# Altium schematic sheet [7] LCD.SchDoc
size A4
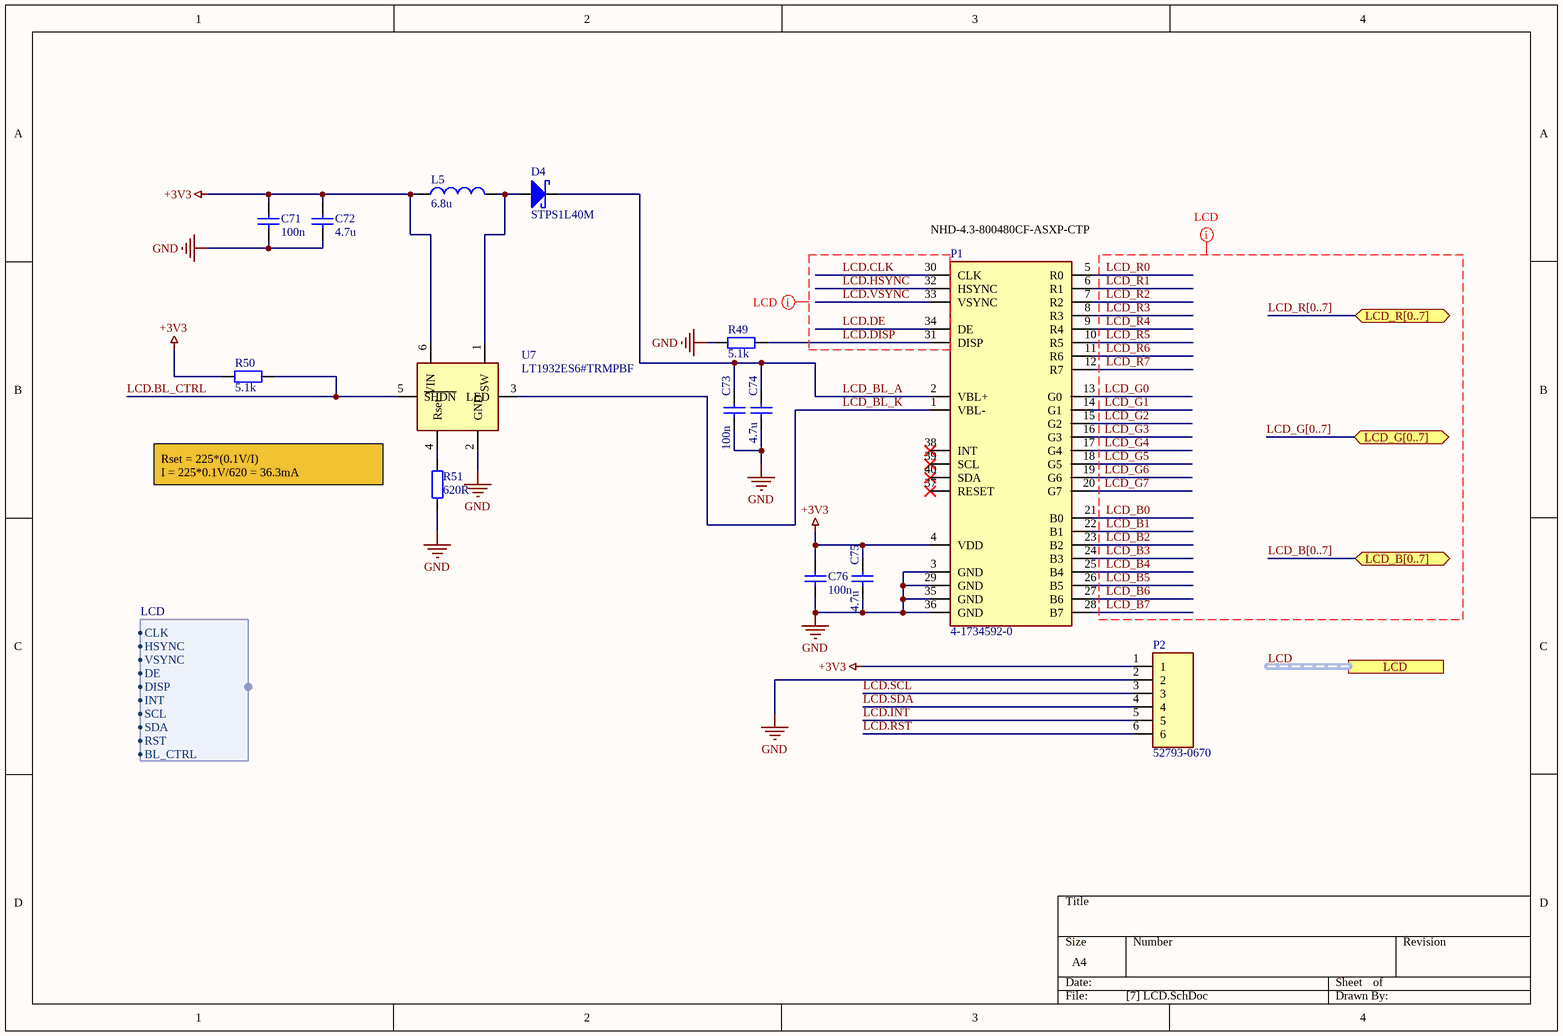
[diagram p0: [7] LCD.SchDoc]

## Parts
C71  100n  [Capacitor 0603]
C72  4.7u  [Capacitor 0603]
C73  100n  [Capacitor 0603]
C74  4.7u  [Capacitor 0603]
C75  4.7u  [Capacitor 0603]
C76  100n  [Capacitor 0603]
D4  STPS1L40M  [DO216-AA]
L5  6.8u  [Inductor ASPI]
P1  4-1734592-0  [Mechanical FFC 0.5mm 40pin]
P2  52793-0670  [Mechanical FFC 1mm 6 pin]
R49  5.1k  [Resistor 0603]
R50  5.1k  [Resistor 0603]
R51  620R  [Resistor 0603]
U7  LT1932ES6#TRMPBF  [SOT23-6]

## Ports
LCD (harness LCD), LCD_B[0..7] (bidir), LCD_G[0..7] (bidir), LCD_R[0..7] (bidir)

## Harnesses
LCD: HSYNC, CLK, VSYNC, DISP, INT, SCL, DE, SDA, RST, BL_CTRL

## Nets
+3V3: C71.2 C72.2 C75.2 C76.2 L5.1 P1.4(VDD) P2.1 R50.1 U7.6(VIN)
GND: C71.1 C72.1 C73.1 C74.1 C75.1 C76.1 P1.3(GND) P1.29(GND) P1.35(GND) P1.36(GND) P2.2 R49.1 R51.1 U7.2(GND)
LCD.BL_CTRL: R50.2 U7.5(~{SHDN})
LCD.CLK: P1.30(CLK)
LCD.DE: P1.34(DE)
LCD.DISP: P1.31(DISP) R49.2
LCD.HSYNC: P1.32(HSYNC)
LCD.INT: P2.5
LCD.RST: P2.6
LCD.SCL: P2.3
LCD.SDA: P2.4
LCD.VSYNC: P1.33(VSYNC)
LCD_B0: P1.21(B0)
LCD_B1: P1.22(B1)
LCD_B2: P1.23(B2)
LCD_B3: P1.24(B3)
LCD_B4: P1.25(B4)
LCD_B5: P1.26(B5)
LCD_B6: P1.27(B6)
LCD_B7: P1.28(B7)
LCD_BL_A: C73.2 C74.2 D4.2 P1.2(VBL+)
LCD_BL_K: P1.1(VBL-) U7.3(LED)
LCD_G0: P1.13(G0)
LCD_G1: P1.14(G1)
LCD_G2: P1.15(G2)
LCD_G3: P1.16(G3)
LCD_G4: P1.17(G4)
LCD_G5: P1.18(G5)
LCD_G6: P1.19(G6)
LCD_G7: P1.20(G7)
LCD_R0: P1.5(R0)
LCD_R1: P1.6(R1)
LCD_R2: P1.7(R2)
LCD_R3: P1.8(R3)
LCD_R4: P1.9(R4)
LCD_R5: P1.10(R5)
LCD_R6: P1.11(R6)
LCD_R7: P1.12(R7)
NetD4_1: D4.1 L5.2 U7.1(SW)
NetR51_2: R51.2 U7.4(Rset)

Not connected (* = marked no-connect by the designer): P1 37(RESET)* 38(INT)* 39(SCL)* 40(SDA)*

## Buses and harness runs
bus LCD_B[0..7] = port LCD_B[0..7]
bus LCD_G[0..7] = port LCD_G[0..7]
bus LCD_R[0..7] = port LCD_R[0..7]
harness LCD = port LCD

## Layout directives
net class LCD: LCD.CLK, LCD.DE, LCD.DISP, LCD.HSYNC, LCD.VSYNC, LCD_B0, LCD_B1, LCD_B2, LCD_B3, LCD_B4, LCD_B5, LCD_B6, LCD_B7, LCD_B[0..7], LCD_G0, LCD_G1, LCD_G2, LCD_G3, LCD_G4, LCD_G5, LCD_G6, LCD_G7, LCD_G[0..7], LCD_R0, LCD_R1, LCD_R2, LCD_R3, LCD_R4, LCD_R5, LCD_R6, LCD_R7, LCD_R[0..7]

## Notes on the sheet
- (near P1) NHD-4.3-800480CF-ASXP-CTP
- Rset = 225*(0.1V/I)
  I = 225*0.1V/620 = 36.3mA

## Library data of the parts
C71 C73 C76 = Capacitor 100n 10% 0603 EMK107B7104KA-T: Multilayer Ceramic Capacitors MLCC - SMD/SMT 0603 16VDC 0.1uF 10% X7R; Manufacturer: Taiyo Yuden; Type: SMD; Manufacturer Part Number: EMK107B7104KA-T; Footprint: 0603; Datasheet: https://pl.mouser.com/datasheet/2/396/mlcc02_e-1307760.pdf
C72 C74 C75 = Capacitor 4.7u 10% 0603 EMK107ABJ475KA-T: Multilayer Ceramic Capacitors MLCC - SMD/SMT 0603 16VDC 4.7uF 10% X5R; Manufacturer: Taiyo Yuden; Type: SMD; Manufacturer Part Number: EMK107ABJ475KA-T; Footprint: 0603; Datasheet: https://pl.mouser.com/datasheet/2/396/mlcc02_e-1307760.pdf
D4 = Diode Schottky Diodes & Rectifiers 1.0 Amp 40 Volt STPS1L40M: Schottky Diodes & Rectifiers 1.0 Amp 40 Volt; Manufacturer: ON Semiconductor / Fairchild; Type: SMD; Manufacturer Part Number: STPS1L40M; Footprint: DO-216AA-2; Datasheet: https://pl.mouser.com/datasheet/2/389/cd00003015-1795949.pdf
L5 = Inductor FIXED IND 6.8UH 900MA 295 MOHM ASPI-2515-6R8M-T2: Fixed Inductors FIXED IND 6.8UH 900MA 295 MOHM; Manufacturer: ABRACON; Type: SMD; Manufacturer Part Number: ASPI-2515-6R8M-T2; Footprint: 2.5 mm x 2 mm; Datasheet: https://pl.mouser.com/datasheet/2/3/ASPI_2515-1774975.pdf
P1 = Mechanical FFC & FPC Connectors FPC CONN 0.5MM PITCH B/C 40P 4-1734592-0: FFC & FPC Connectors FPC CONN 0.5MM PITCH B/C 40P; Manufacturer: TE Connectivity; Manufacturer Part Number: 4-1734592-0; Footprint: 40 Position; Type: SMD; Datasheet: https://www.te.com/commerce/DocumentDelivery/DDEController?Action=srchrtrv&DocNm=1734592&DocType=Customer+Drawing&DocLang=English&PartCntxt=4-1734592-0&DocFormat=pdf
P2 = Mechanical FFC & FPC Connectors 1.0 FFC Non ZIF HsgA ssySMT 6CktEmbsTpPkg 52793-0670: FFC & FPC Connectors 1.0 FFC Non ZIF HsgA ssySMT 6CktEmbsTpPkg; Manufacturer: Molex; Manufacturer Part Number: 52793-0670; Footprint: 6 Position; Type: SMD; Datasheet: https://pl.mouser.com/datasheet/2/276/0527930670_FFC_FPC_CONNECTORS-170651.pdf
R49 R50 = Resistor 5.1k 1% 0603 RT0603FRE075K1L: Thin Film Resistors - SMD 1/10W 5.1K ohm 1% 50ppm; Manufacturer: Yageo; Manufacturer Part Number: RT0603FRE075K1L; Footprint: 0603; Type: SMD; Datasheet: https://pl.mouser.com/datasheet/2/447/PYu_RT_1_to_0_01_RoHS_L_11-1669912.pdf
R51 = Resistor 620R 1% 0603 RT0603FRE07620RL: Thin Film Resistors - SMD 620 OHM 1% 50PPM 1/10W; Manufacturer: Yageo; Manufacturer Part Number: RT0603FRE07620RL; Footprint: 0603; Type: SMD; Datasheet: https://pl.mouser.com/datasheet/2/447/PYu_RT_1_to_0_01_RoHS_L_11-1669912.pdf
U7 = IC LED Lighting Drivers Boost Regulator LED Driver: LED Lighting Drivers Boost Regulator LED Driver; Manufacturer: Analog Devices; Manufacturer Part Number: LT1932ES6#TRMPBF; Footprint: SOT-23-6; Type: SMD; Datasheet: https://pl.mouser.com/datasheet/2/609/1932f-1269198.pdf